# Altium schematic sheet Input2.SchDoc
size A4
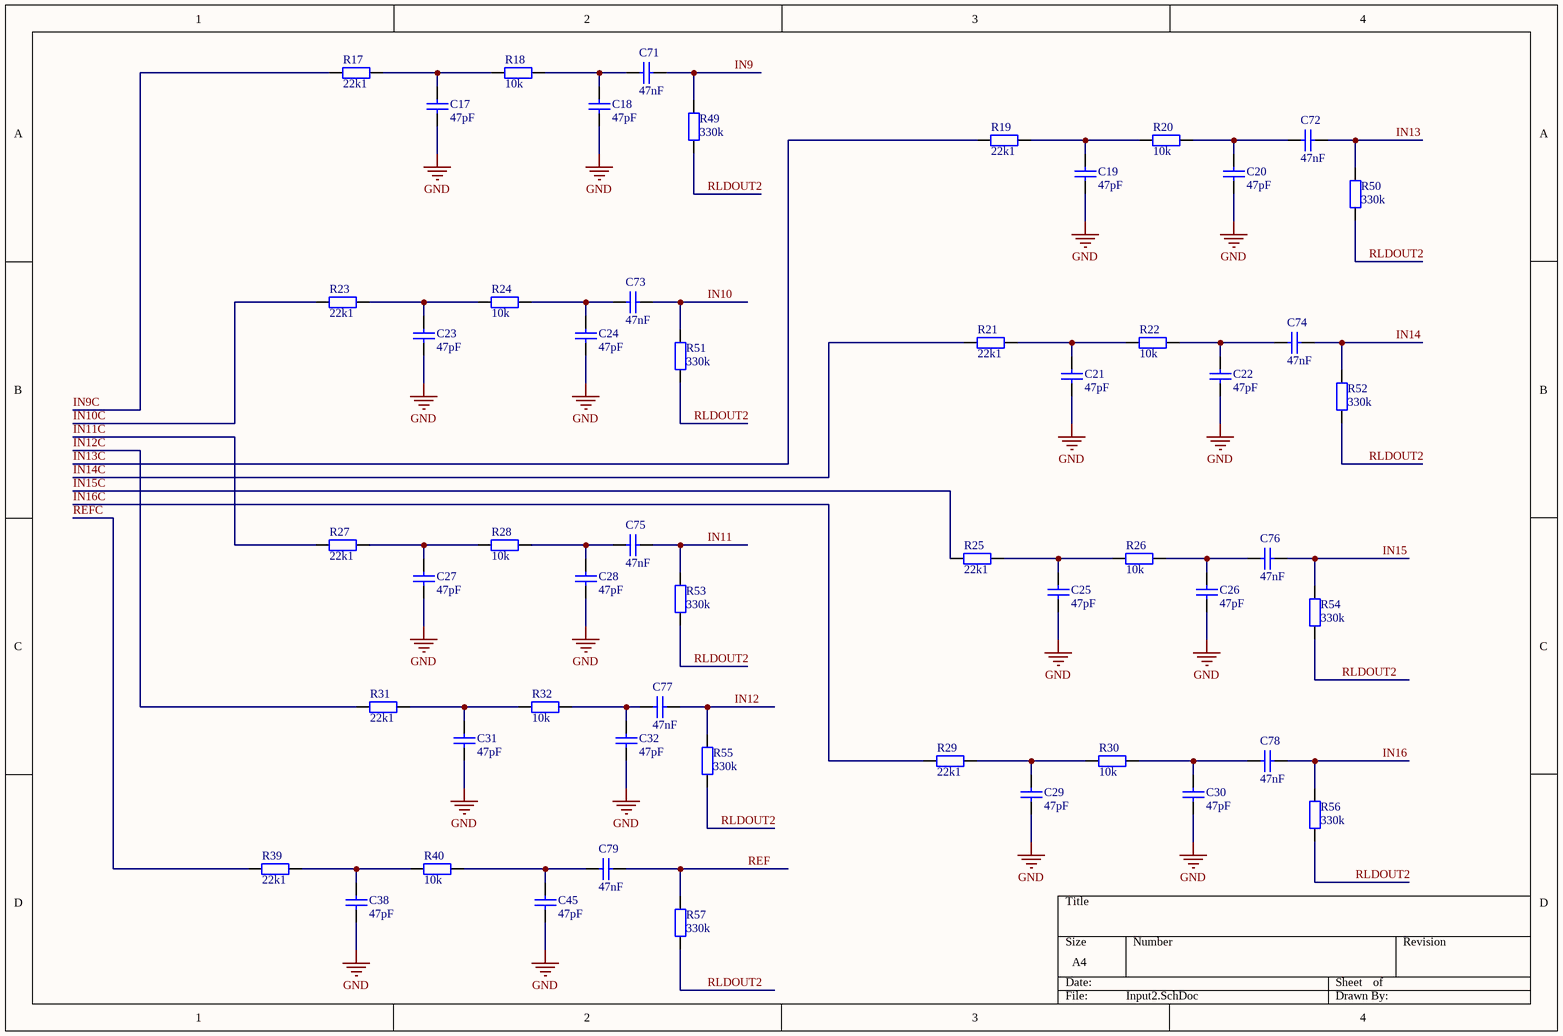
[diagram p0: Input2.SchDoc]

## Parts
C17  47pF  [C0603]
C18  47pF  [C0603]
C19  47pF  [C0603]
C20  47pF  [C0603]
C21  47pF  [C0603]
C22  47pF  [C0603]
C23  47pF  [C0603]
C24  47pF  [C0603]
C25  47pF  [C0603]
C26  47pF  [C0603]
C27  47pF  [C0603]
C28  47pF  [C0603]
C29  47pF  [C0603]
C30  47pF  [C0603]
C31  47pF  [C0603]
C32  47pF  [C0603]
C38  47pF  [C0603]
C45  47pF  [C0603]
C71  47nF  [C0603]
C72  47nF  [C0603]
C73  47nF  [C0603]
C74  47nF  [C0603]
C75  47nF  [C0603]
C76  47nF  [C0603]
C77  47nF  [C0603]
C78  47nF  [C0603]
C79  47nF  [C0603]
R17  22k1  [RES0603]
R18  10k  [RES0603]
R19  22k1  [RES0603]
R20  10k  [RES0603]
R21  22k1  [RES0603]
R22  10k  [RES0603]
R23  22k1  [RES0603]
R24  10k  [RES0603]
R25  22k1  [RES0603]
R26  10k  [RES0603]
R27  22k1  [RES0603]
R28  10k  [RES0603]
R29  22k1  [RES0603]
R30  10k  [RES0603]
R31  22k1  [RES0603]
R32  10k  [RES0603]
R39  22k1  [RES0603]
R40  10k  [RES0603]
R49  330k  [RES0603]
R50  330k  [RES0603]
R51  330k  [RES0603]
R52  330k  [RES0603]
R53  330k  [RES0603]
R54  330k  [RES0603]
R55  330k  [RES0603]
R56  330k  [RES0603]
R57  330k  [RES0603]

## Nets
GND: C17.1 C18.1 C19.1 C20.1 C21.1 C22.1 C23.1 C24.1 C25.1 C26.1 C27.1 C28.1 C29.1 C30.1 C31.1 C32.1 C38.1 C45.1
IN9: C71.1 R49.2
IN9C: R17.1
IN10: C73.1 R51.2
IN10C: R23.1
IN11: C75.1 R53.2
IN11C: R27.1
IN12: C77.1 R55.2
IN12C: R31.1
IN13: C72.1 R50.2
IN13C: R19.1
IN14: C74.1 R52.2
IN14C: R21.1
IN15: C76.1 R54.2
IN15C: R25.1
IN16: C78.1 R56.2
IN16C: R29.1
REF: C79.1 R57.2
REFC: R39.1
RLDOUT2: R49.1 R50.1 R51.1 R52.1 R53.1 R54.1 R55.1 R56.1 R57.1
NetC17_2: C17.2 R17.2 R18.1
NetC18_2: C18.2 C71.2 R18.2
NetC19_2: C19.2 R19.2 R20.1
NetC20_2: C20.2 C72.2 R20.2
NetC21_2: C21.2 R21.2 R22.1
NetC22_2: C22.2 C74.2 R22.2
NetC23_2: C23.2 R23.2 R24.1
NetC24_2: C24.2 C73.2 R24.2
NetC25_2: C25.2 R25.2 R26.1
NetC26_2: C26.2 C76.2 R26.2
NetC27_2: C27.2 R27.2 R28.1
NetC28_2: C28.2 C75.2 R28.2
NetC29_2: C29.2 R29.2 R30.1
NetC30_2: C30.2 C78.2 R30.2
NetC31_2: C31.2 R31.2 R32.1
NetC32_2: C32.2 C77.2 R32.2
NetC38_2: C38.2 R39.2 R40.1
NetC45_2: C45.2 C79.2 R40.2

## Library data of the parts
C17-C32 C38 C45 C71-C79 = Cap: Capacitor; Value: 100pF; Published: 8-Jun-2000; LatestRevisionDate: 17-Jul-2002; LatestRevisionNote: Re-released for DXP Platform.; PackageReference: RAD-0.3; Publisher: Altium Limited; PackageDescription: Radial Cap, Thru-Hole; 2 Leads; 0.3 in Pin Spacing
R17-R32 R39 R40 R49-R57 = Res2: Resistor; Value: 1K; Published: 8-Jun-2000; LatestRevisionDate: 17-Jul-2002; LatestRevisionNote: Re-released for DXP Platform.; PackageReference: AXIAL-0.4; Publisher: Altium Limited; PackageDescription: Axial Device, Thru-Hole; 2 Leads; 0.4 in Pin Spacing